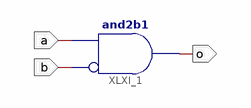
[diagram p0: schematic sheet 1]
// Xilinx ISE schematic test.sch (artix7) as structural Verilog: 1 symbols, 3 ports
module test (
  input  b,
  input  a,
  output o
);

  and XLXI_1 (o, ~b, a);  // and2b1
endmodule
